# Altium schematic sheet Micro.SchDoc
size A4
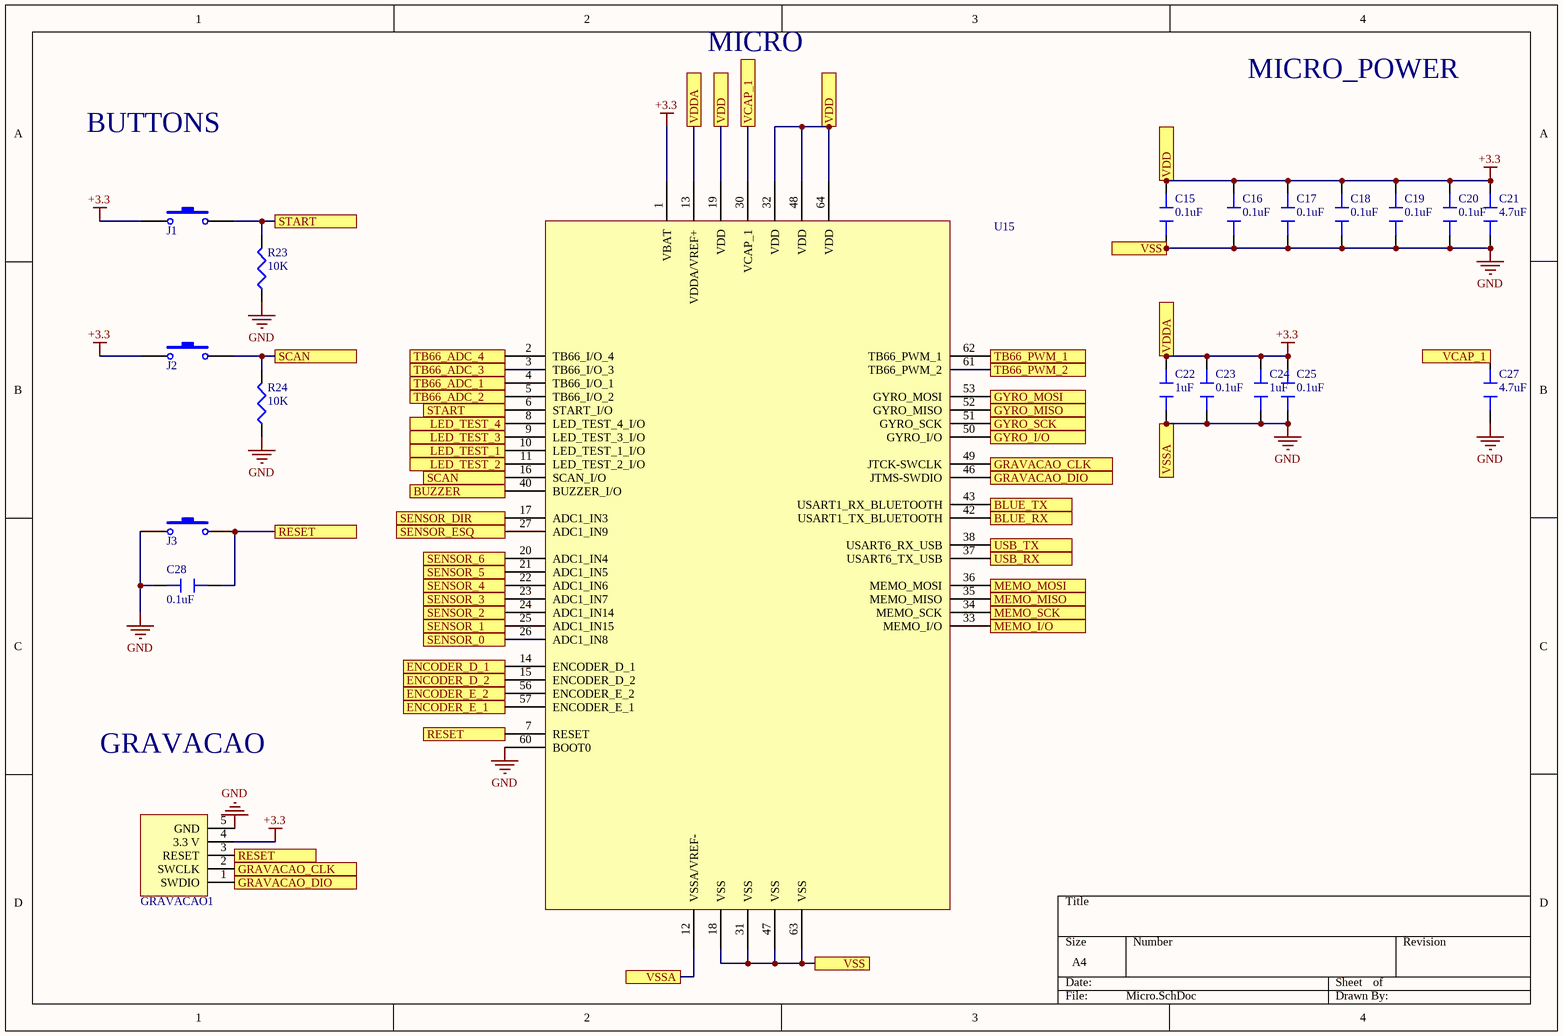
[diagram p0: Micro.SchDoc]

## Parts
C15  0.1uF  [CAPACITOR 0805]
C16  0.1uF  [CAPACITOR 0805]
C17  0.1uF  [CAPACITOR 0805]
C18  0.1uF  [CAPACITOR 0805]
C19  0.1uF  [CAPACITOR 0805]
C20  0.1uF  [CAPACITOR 0805]
C21  4.7uF  [CAPACITOR 0805]
C22  1uF  [CAPACITOR 0805]
C23  0.1uF  [CAPACITOR 0805]
C24  1uF  [CAPACITOR 0805]
C25  0.1uF  [CAPACITOR 0805]
C27  4.7uF  [CAPACITOR 0805]
C28  0.1uF  [CAPACITOR 0805]
GRAVACAO1  Headers (1x5)  [HDR1X5]  (value not drawn)
J1  BUTTON  [FSM4JSMA]  (value not drawn)
J2  BUTTON  [FSM4JSMA]  (value not drawn)
J3  BUTTON  [FSM4JSMA]  (value not drawn)
R23  10K  [6-0805_M]
R24  10K  [6-0805_M]
U15  ARM Microcontrollers  [QFP50P1200X1200X160-64N]  (value not drawn)

## Ports
BLUE_RX, BLUE_TX, BUZZER, ENCODER_D_1, ENCODER_D_2, ENCODER_E_1, ENCODER_E_2, GRAVACAO_CLK, GRAVACAO_DIO, GYRO_I/O, GYRO_MISO, GYRO_MOSI, GYRO_SCK, LED_TEST_1, LED_TEST_2, LED_TEST_3, LED_TEST_4, MEMO_I/O, MEMO_MISO, MEMO_MOSI, MEMO_SCK, RESET, SCAN, SENSOR_0, SENSOR_1, SENSOR_2, SENSOR_3, SENSOR_4, SENSOR_5, SENSOR_6, SENSOR_DIR, SENSOR_ESQ, START, TB66_ADC_1, TB66_ADC_2, TB66_ADC_3, TB66_ADC_4, TB66_PWM_1, TB66_PWM_2, USB_RX, USB_TX, VCAP_1, VDD, VDDA, VSS, VSSA

## Nets
+3.3: C15.2 C16.2 C17.2 C18.2 C19.2 C20.2 C21.2 C22.2 C23.2 C24.2 C25.2 GRAVACAO1.4(3.3_V) J1.1 J2.1 U15.1(VBAT) U15.13(VDDA/VREF+) U15.19(VDD) U15.32(VDD) U15.48(VDD) U15.64(VDD) ; port VDD, port VDDA
GND: C15.1 C16.1 C17.1 C18.1 C19.1 C20.1 C21.1 C22.1 C23.1 C24.1 C25.1 C27.1 C28.1 GRAVACAO1.5(GND) J3.1 R23.1 R24.1 U15.12(VSSA/VREF-) U15.18(VSS) U15.31(VSS) U15.47(VSS) U15.60(BOOT0) U15.63(VSS) ; port VSS, port VSSA
BLUE_RX: U15.42(USART1_TX_BLUETOOTH) ; port BLUE_RX
BLUE_TX: U15.43(USART1_RX_BLUETOOTH) ; port BLUE_TX
BUZZER: U15.40(BUZZER_I/O) ; port BUZZER
ENCODER_D_1: U15.14(ENCODER_D_1) ; port ENCODER_D_1
ENCODER_D_2: U15.15(ENCODER_D_2) ; port ENCODER_D_2
ENCODER_E_1: U15.57(ENCODER_E_1) ; port ENCODER_E_1
ENCODER_E_2: U15.56(ENCODER_E_2) ; port ENCODER_E_2
GRAVACAO_CLK: GRAVACAO1.2(SWCLK) U15.49(JTCK-SWCLK) ; port GRAVACAO_CLK
GRAVACAO_DIO: GRAVACAO1.1(SWDIO) U15.46(JTMS-SWDIO) ; port GRAVACAO_DIO
GYRO_I/O: U15.50(GYRO_I/O) ; port GYRO_I/O
GYRO_MISO: U15.52(GYRO_MISO) ; port GYRO_MISO
GYRO_MOSI: U15.53(GYRO_MOSI) ; port GYRO_MOSI
GYRO_SCK: U15.51(GYRO_SCK) ; port GYRO_SCK
LED_TEST_1: U15.10(LED_TEST_1_I/O) ; port LED_TEST_1
LED_TEST_2: U15.11(LED_TEST_2_I/O) ; port LED_TEST_2
LED_TEST_3: U15.9(LED_TEST_3_I/O) ; port LED_TEST_3
LED_TEST_4: U15.8(LED_TEST_4_I/O) ; port LED_TEST_4
MEMO_I/O: U15.33(MEMO_I/O) ; port MEMO_I/O
MEMO_MISO: U15.35(MEMO_MISO) ; port MEMO_MISO
MEMO_MOSI: U15.36(MEMO_MOSI) ; port MEMO_MOSI
MEMO_SCK: U15.34(MEMO_SCK) ; port MEMO_SCK
RESET: C28.2 GRAVACAO1.3(RESET) J3.2 U15.7(RESET) ; port RESET
SCAN: J2.2 R24.2 U15.16(SCAN_I/O) ; port SCAN
SENSOR_0: U15.26(ADC1_IN8) ; port SENSOR_0
SENSOR_1: U15.25(ADC1_IN15) ; port SENSOR_1
SENSOR_2: U15.24(ADC1_IN14) ; port SENSOR_2
SENSOR_3: U15.23(ADC1_IN7) ; port SENSOR_3
SENSOR_4: U15.22(ADC1_IN6) ; port SENSOR_4
SENSOR_5: U15.21(ADC1_IN5) ; port SENSOR_5
SENSOR_6: U15.20(ADC1_IN4) ; port SENSOR_6
SENSOR_DIR: U15.17(ADC1_IN3) ; port SENSOR_DIR
SENSOR_ESQ: U15.27(ADC1_IN9) ; port SENSOR_ESQ
START: J1.2 R23.2 U15.6(START_I/O) ; port START
TB66_ADC_1: U15.4(TB66_I/O_1) ; port TB66_ADC_1
TB66_ADC_2: U15.5(TB66_I/O_2) ; port TB66_ADC_2
TB66_ADC_3: U15.3(TB66_I/O_3) ; port TB66_ADC_3
TB66_ADC_4: U15.2(TB66_I/O_4) ; port TB66_ADC_4
TB66_PWM_1: U15.62(TB66_PWM_1) ; port TB66_PWM_1
TB66_PWM_2: U15.61(TB66_PWM_2) ; port TB66_PWM_2
USB_RX: U15.37(USART6_TX_USB) ; port USB_RX
USB_TX: U15.38(USART6_RX_USB) ; port USB_TX
VCAP_1: C27.2 U15.30(VCAP_1) ; port VCAP_1

## Notes on the sheet
- MICRO
- MICRO_POWER
- BUTTONS
- GRAVACAO

## Library data of the parts
C15-C20 C23 C25 C28 = Capacitor  0.1uF 0805: Multilayer Ceramic Capacitors MLCC - SMD/SMT .1uF 50volts 10%; Manufacturer: Vishay Vitramon; Manufacturer Part Number: VJ0805Y104KXAAT; Capacitance: 100nF; Voltage Rating: 50V; Dielectric: X7R; Supplier 1: Mouser; Stock 1: 207342; Pricing 1: 1=0.2, 10=0.2, 50=0.162, 100=0.108, 500=0.095, 1000=0.084, 3000=0.072, 6000=0.069, 9000=0.065, 10000=0.065 (USD); Mount: Surface Mount; Case/Package: 0805; Weight: 0.000194oz; Case Code (Metric): 2012; Case Code (Imperial): 0805; Min Operating Temperature: -55°C; Max Operating Temperature: 125°C; Tolerance: 10%; Package Quantity: 1; Packaging: Tape and Reel; Voltage Rating (DC): 50V; Termination: SMD/SMT; Voltage: 50V; Length: 2mm; Height: 1.45mm; Width: 0.049inch; Thickness: 0.057inch; Depth: 1.25mm; Radiation Hardening: No; REACH SVHC: Unknown; Lead Free: Lead Free; ComponentLink1URL: http://www.mouser.com/ds/2/427/vjcommercialseries-222796.pdf?src-supplier=Mouser; ComponentLink1Description: http://www.mouser.com/ds/2/427/vjcommercialseries-222796.pdf?src-supplier=Mouser; ComponentLink2URL: http://www.vishay.com/docs/45199/vjcommercialseries.pdf?src-supplier=Digi-Key; ComponentLink2Description: http://www.vishay.com/docs/45199/vjcommercialseries.pdf?src-supplier=Digi-Key; ComponentLink3URL: http://www.vishay.com/docs/45199/vjcommercialseries.pdf?src-supplier=Future+Electronics; ComponentLink3Description: http://www.vishay.com/docs/45199/vjcommercialseries.pdf?src-supplier=Future+Electronics; Supplier Part Number 1: 77-VJ0805Y104KXAAT; Category: Multilayer Ceramic Capacitors MLCC - SMD/SMT
C21 C27 = Capacitor 4.7uF 0805: MURATA - GRM21BR61H475KE51L - CAP, 4.7µF, 50V, 10%, X5R, 0805; Material: Ceramic; Supplier 1: Mouser; Manufacturer: Murata; Manufacturer Part Number: GRM21BR61H475KE51L; Stock 1: 243744; Pricing 1: 1=0.37, 10=0.256, 50=0.256, 100=0.153, 500=0.115, 1000=0.097, 3000=0.08, 6000=0.075, 9000=0.071, 10000=0.071 (USD); Mount: Surface Mount; Case/Package: 0805; Case Code (Metric): 2012; Case Code (Imperial): 0805; Min Operating Temperature: -55°C; Max Operating Temperature: 85°C; Capacitance: 4.7uF; Tolerance: 10%; Packaging: Tape and Reel; Dielectric: X5R; Voltage Rating: 50V; Voltage Rating (DC): 50V; Length: 2mm; Height: 1.25mm; Width: 0.049inch; Thickness: 0.055inch; Depth: 1.25mm; REACH SVHC: No SVHC; Lead Free: Lead Free; ComponentLink1URL: http://components.arrow.com/part/dataview/61084395S454511N2606?src-supplier=Arrow; ComponentLink1Description: http://components.arrow.com/part/dataview/61084395S454511N2606?src-supplier=Arrow; ComponentLink2URL: http://components.arrow.com/part/dataview/0323_07281654?src-supplier=Arrow+Europe; ComponentLink2Description: http://components.arrow.com/part/dataview/0323_07281654?src-supplier=Arrow+Europe; ComponentLink3URL: https://search.murata.co.jp/Ceramy/image/img/A01X/G101/ENG/GRM21BR61H475KE51-01.pdf?src-supplier=Digi-Key; ComponentLink3Description: https://search.murata.co.jp/Ceramy/image/img/A01X/G101/ENG/GRM21BR61H475KE51-01.pdf?src-supplier=Digi-Key; ComponentLink4URL: http://search.murata.co.jp/Ceramy/image/img/A01X/G101/ENG/GRM21BR61H475KE51-01.pdf?src-supplier=Digi-Key; ComponentLink4Description: http://search.murata.co.jp/Ceramy/image/img/A01X/G101/ENG/GRM21BR61H475KE51-01.pdf?src-supplier=Digi-Key; ComponentLink5URL: http://www.farnell.com/datasheets/2079186.pdf?src-supplier=Farnell; ComponentLink5Description: http://www.farnell.com/datasheets/2079186.pdf?src-supplier=Farnell; ComponentLink6URL: http://www.farnell.com/datasheets/2079186.pdf?src-supplier=Element14; ComponentLink6Description: http://www.farnell.com/datasheets/2079186.pdf?src-supplier=Element14; ComponentLink7URL: http://www.farnell.com/datasheets/2079186.pdf?src-supplier=Newark; ComponentLink7Description: http://www.farnell.com/datasheets/2079186.pdf?src-supplier=Newark; Supplier Part Number 1: 81-GRM21BR61H475KE1L; Category: Multilayer Ceramic Capacitors MLCC - SMD/SMT
C22 C24 = Capacitor 1uF 0805: Cap Ceramic 1uF 25V X7R 10% SMD 0805 125C Blister T/R; Manufacturer: Vishay; Manufacturer Part Number: VJ0805Y105KXXTW1BC; Dielectric Material: Tantalum; Supplier 1: Mouser; Stock 1: 40011; Pricing 1: 1=0.11, 10=0.11, 50=0.11, 100=0.055, 1000=0.038, 10000=0.038 (USD); Mount: Surface Mount; Case/Package: 0805; Min Operating Temperature: -55°C; Max Operating Temperature: 125°C; Capacitance: 1uF; Tolerance: 10%; Dielectric: X7R; Termination: Wraparound; Packaging: Tape and Reel; Voltage Rating (DC): 25V; Length: 2mm; Height: 1.25mm; Depth: 1.25mm; Radiation Hardening: No; Lead Free: Lead Free; ComponentLink1URL: http://www.vishay.com/docs/28548/vjw1bcbascomseries.pdf?src-supplier=Avnet+Europe; ComponentLink1Description: http://www.vishay.com/docs/28548/vjw1bcbascomseries.pdf?src-supplier=Avnet+Europe; Supplier Part Number 1: 77-VJ805Y105KXXTW1BC; Category: Multilayer Ceramic Capacitors MLCC - SMD/SMT
GRAVACAO1 = Headers (1x5): Conn Unshrouded Header HDR 5 POS 2.54mm Solder ST Thru-Hole Bag; Manufacturer: Molex; Manufacturer Part Number: 0022284053; Contact Resistance: 20mR; Number of Positions: 5; Max Voltage Rating (AC): 250V; Gender: Male; Connector Type: Male Pin; Supplier 1: Mouser; Stock 1: 10577; Pricing 1: 1=0.4, 10=0.373, 25=0.335, 50=0.298, 100=0.286, 250=0.261, 500=0.248, 1000=0.205, 2500=0.186, 10000=0.186 (USD); Mount: Through Hole; Color: Black; Contact Plating: Gold; Contact Material: Bronze; Housing Color: Black; Housing Material: Nylon; Min Operating Temperature: 0°C; Max Operating Temperature: 75°C; Package Quantity: 1; Packaging: Bulk; Number of Rows: 1; Termination: Solder; Number of Contacts: 5; Max Voltage Rating (DC): 250V; Orientation: Straight; Length: 12.7mm; Pitch: 2.54mm; Contact Mating Length: 0.24inch; Depth: 2.49mm; ComponentLink1URL: http://www.molex.com/webdocs/datasheets/pdf/en-us/0022284053_PCB_HEADERS.pdf?src-supplier=Avnet; ComponentLink1Description: http://www.molex.com/webdocs/datasheets/pdf/en-us/0022284053_PCB_HEADERS.pdf?src-supplier=Avnet; ComponentLink2URL: http://www.molex.com/pdm_docs/sd/022284053_sd.pdf?src-supplier=Digi-Key; ComponentLink2Description: http://www.molex.com/pdm_docs/sd/022284053_sd.pdf?src-supplier=Digi-Key; Supplier Part Number 1: 538-22-28-4053; Category: Headers & Wire Housings
J1-J3 = Switch: Manufacturer: Panasonic; Manufacturer Part Number: EVP-BFAC1A000; Mechanical Life: 1000000Cycles; Throw Configuration: SPST; Illumination Type: Non-Illuminated; Switch Function: Off-Mom; Operating Force: 200gf; Switch Travel: 0.25mm; Supplier 1: Mouser; Stock 1: 3866; Pricing 1: 1=0.3, 10=0.265, 100=0.203, 1000=0.173, 2000=0.134, 9000=0.134 (USD); Mount: Surface Mount; Min Operating Temperature: -40°C; Max Operating Temperature: 85°C; Packaging: Tape and Reel; ComponentLink1URL: https://industrial.panasonic.com/ac/cdn/e/control/switch/light-touch/catalog/sw_lt_eng_6s_mid.pdf?src-supplier=Digi-Key; ComponentLink1Description: https://industrial.panasonic.com/ac/cdn/e/control/switch/light-touch/catalog/sw_lt_eng_6s_mid.pdf?src-supplier=Digi-Key; Category: Tactile Switches; Supplier Part Number 1: 667-EVP-BFAC1A000
R23 R24 = Resistor 10k 0805: RES SMD 10K OHM 1% 1/8W 0805; Manufacturer: Vishay; Manufacturer Part Number: CRCW080510K0FKEA; Resistance: 10kR; Power Rating: 125mW; Voltage Rating: 150V; Temperature Coefficient: 100ppm/°C; Supplier 1: Mouser; Stock 1: 474662; Pricing 1: 1=0.1, 10=0.066, 50=0.066, 100=0.06, 1000=0.043, 10000=0.019 (USD); Case/Package: 0805; Weight: 0.000194oz; Case Code (Imperial): 0805; Case Code (Metric): 2012; Contact Plating: Tin; Min Operating Temperature: -55°C; Max Operating Temperature: 155°C; Tolerance: 1%; Packaging: Tape and Reel; Package Quantity: 5000; Composition: Thick Film; Military Standard: Not; Termination: SMD/SMT; Voltage Rating (DC): 150V; Length: 2mm; Height: 0.45mm; Width: 1.25mm; Depth: 1.25mm; Radiation Hardening: No; REACH SVHC: Unknown; Lead Free: Lead Free; ComponentLink1URL: http://www.mouser.com/ds/2/427/dcrcwe3-109170.pdf?src-supplier=Mouser; ComponentLink1Description: http://www.mouser.com/ds/2/427/dcrcwe3-109170.pdf?src-supplier=Mouser; ComponentLink2URL: http://uk.rs-online.com/webdocs/0d98/0900766b80d98b26.pdf?src-supplier=RSComponents; ComponentLink2Description: http://uk.rs-online.com/webdocs/0d98/0900766b80d98b26.pdf?src-supplier=RSComponents; ComponentLink3URL: http://www.alliedelec.com/m/d/0c934d6939ccefa68dbe0b96d821c8cf.pdf?src-supplier=Allied+Electronics; ComponentLink3Description: http://www.alliedelec.com/m/d/0c934d6939ccefa68dbe0b96d821c8cf.pdf?src-supplier=Allied+Electronics; ComponentLink4URL: http://www.vishay.com/docs/20035/dcrcwe3.pdf?src-supplier=Avnet+Asia; ComponentLink4Description: http://www.vishay.com/docs/20035/dcrcwe3.pdf?src-supplier=Avnet+Asia; ComponentLink5URL: http://www.vishay.com/docs/20035/dcrcwe3.pdf?src-supplier=Avnet+Europe; ComponentLink5Description: http://www.vishay.com/docs/20035/dcrcwe3.pdf?src-supplier=Avnet+Europe; ComponentLink6URL: http://www.vishay.com/docs/20035/dcrcwe3.pdf?src-supplier=Avnet; ComponentLink6Description: http://www.vishay.com/docs/20035/dcrcwe3.pdf?src-supplier=Avnet; ComponentLink7URL: http://www.farnell.com/datasheets/2310790.pdf?src-supplier=Element14; ComponentLink7Description: http://www.farnell.com/datasheets/2310790.pdf?src-supplier=Element14; ComponentLink8URL: http://www.vishay.com/docs/20035/dcrcwe3.pdf?src-supplier=Future+Electronics; ComponentLink8Description: http://www.vishay.com/docs/20035/dcrcwe3.pdf?src-supplier=Future+Electronics; Supplier Part Number 1: 71-CRCW0805-10K-E3; Category: Thick Film Resistors - SMD
U15 = ARM Microcontrollers: MCU 32-bit STM32 ARM Cortex M4 RISC 128KB Flash 1.8V/2.5V/3.3V 64-Pin LQFP Tray; Manufacturer: STMicroelectronics; Manufacturer Part Number: STM32F401RBT6; RAM Size: 64KB; Max Power Dissipation: 313mW; Interface: I2C,SPI,I2S,USART,USB,IrDA,SDIO,UART,LIN; Number of I/Os: 50; Number of Timers/Counters: 8; Frequency: 84MHz; Max Supply Voltage: 3.6V; Min Supply Voltage: 1.8V; Oscillator Type: Internal; Data Bus Width: 32b; Watchdog Timer: Yes; Peripherals: Brown-out Detect/Reset,POR,PWM,WDT,DMA; Number of USB Channels: 1; Number of SPI Channels: 7; Operating Supply Voltage: 3.3V; Number of I2C Channels: 3; Number of PWM Channels: 4; Supplier 1: Mouser; Stock 1: 918; Pricing 1: 1=4.58, 10=4, 50=4, 100=3.37, 250=2.9, 500=2.81, 1000=2.42, 10000=2.42 (USD); Case/Package: LQFP; Number of Pins: 64; Weight: 0.012088oz; Min Operating Temperature: -40°C; Max Operating Temperature: 85°C; Memory Type: FLASH; Packaging: Tray; Number of Programmable I/O: 50; Max Frequency: 84MHz; Memory Size: 128KB; Core Architecture: ARM; Package Quantity: 960; Number of ADC Channels: 1; Length: 10mm; Height: 1.45mm; Width: 10mm; Radiation Hardening: No; REACH SVHC: No SVHC; Lead Free: Lead Free; Supplier Part Number 1: 511-STM32F401RBT6; Category: ARM Microcontrollers - MCU